# EAGLE design massmfg_tinyx4_v1_1 (EAGLE 6.4)
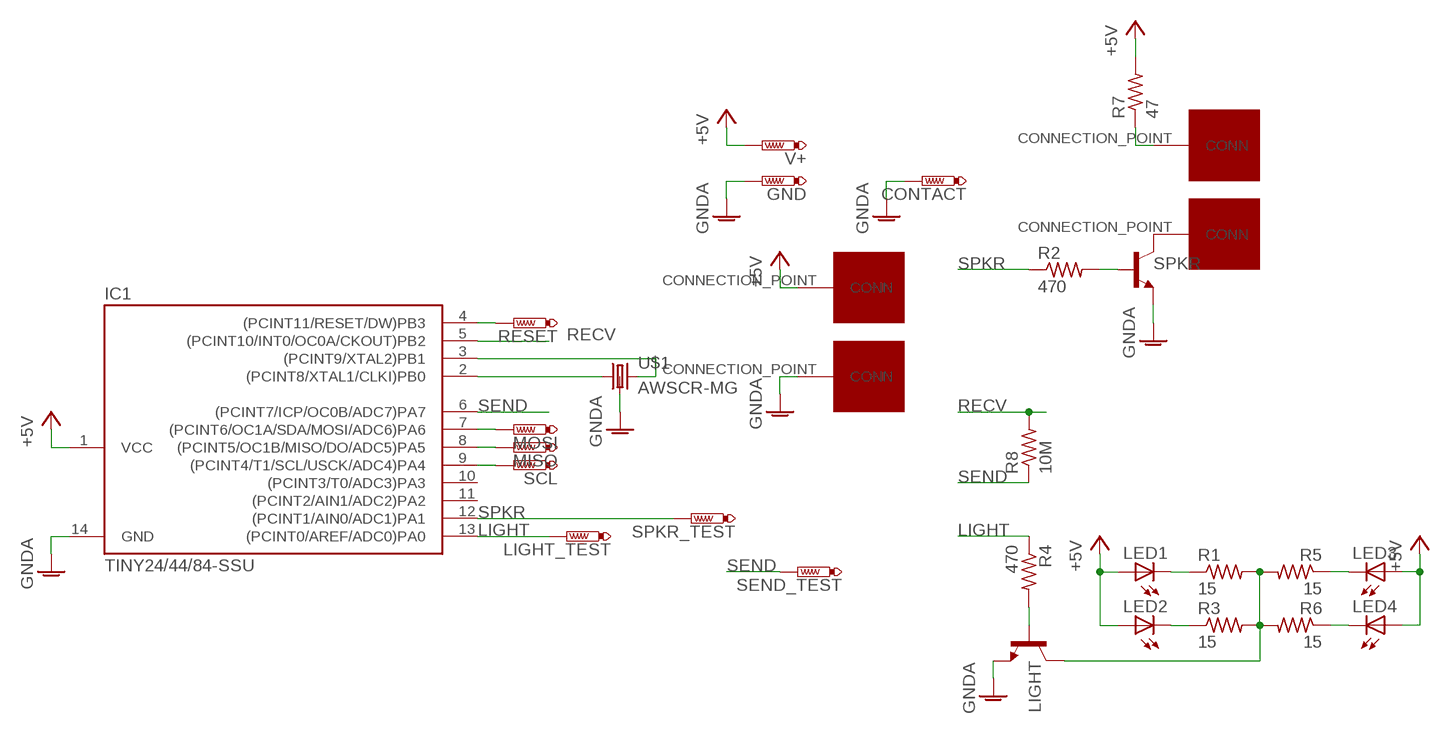
[diagram p0: schematic, sheet 1]

## Parts
CONTACT  PTR1  [P1-06]
GND  PTR1  [P1-06]
IC1  TINY24/44/84-SSU  [SOIC14]
LED1  LEDOPTEK-DURIS5  [OPTEK-DURIS5]
LED2  LEDOPTEK-DURIS5  [OPTEK-DURIS5]
LED3  LEDOPTEK-DURIS5  [OPTEK-DURIS5]
LED4  LEDOPTEK-DURIS5  [OPTEK-DURIS5]
LIGHT  SOT23-BEC  [SOT23-BEC]
LIGHT_TEST  PTR1  [P1-06]
MISO  PTR1  [P1-06]
MOSI  PTR1  [P1-06]
R1  15  R-US_M1206  [M1206]
R2  470  R-US_R0805  [R0805]
R3  15  R-US_M1206  [M1206]
R4  470  R-US_R0805  [R0805]
R5  15  R-US_M1206  [M1206]
R6  15  R-US_M1206  [M1206]
R7  47  R-US_M1206  [M1206]
R8  10M  R-US_M1206  [M1206]
RESET  PTR1  [P1-06]
SCL  PTR1  [P1-06]
SEND_TEST  PTR1  [P1-06]
SPEAKER_PLUS  CONNECTION_POINT  [10X3_CONNECTION_POINT]
SPKR  SOT23-BEC  [SOT23-BEC]
SPKR_MINUS  CONNECTION_POINT  [10X3_CONNECTION_POINT]
SPKR_TEST  PTR1  [P1-06]
U$1  AWSCR-MG  [AWSCR-MG]
U$3  CONNECTION_POINT  [10X3_CONNECTION_POINT]
U$5  CONNECTION_POINT  [10X3_CONNECTION_POINT]
V+  PTR1  [P1-06]

## Nets
+5V: IC1.1(VCC) LED1.ANODE(A) LED2.ANODE(A) LED3.ANODE(A) LED4.ANODE(A) R7.2 U$3.CONNECTION_POINT(CONN) V+.TP
GNDA: CONTACT.TP GND.TP IC1.14(GND) LIGHT.E SPKR.E U$1.GND U$5.CONNECTION_POINT(CONN)
LIGHT: IC1.13((PCINT0/AREF/ADC0)PA0) LIGHT_TEST.TP R4.1
N$1: LIGHT.B R4.2
N$2: IC1.2((PCINT8/XTAL1/CLKI)PB0) U$1.IN
N$3: LED2.CATHODE(C) R3.1
N$4: IC1.3((PCINT9/XTAL2)PB1) U$1.OUT
N$5: LED1.CATHODE(C) R1.1
N$6: R2.2 SPKR.B
N$7: LED3.CATHODE(C) R5.1
N$8: LED4.CATHODE(C) R6.1
N$9: SPKR.C SPKR_MINUS.CONNECTION_POINT(CONN)
N$12: IC1.4((PCINT11/RESET/DW)PB3) RESET.TP
N$13: IC1.7((PCINT6/OC1A/SDA/MOSI/ADC6)PA6) MOSI.TP
N$14: IC1.8((PCINT5/OC1B/MISO/DO/ADC5)PA5) MISO.TP
N$15: IC1.9((PCINT4/T1/SCL/USCK/ADC4)PA4) SCL.TP
N$17: R7.1 SPEAKER_PLUS.CONNECTION_POINT(CONN)
N$18: LIGHT.C R1.2 R3.2 R5.2 R6.2
RECV: IC1.5((PCINT10/INT0/OC0A/CKOUT)PB2) R8.2
SEND: IC1.6((PCINT7/ICP/OC0B/ADC7)PA7) R8.1 SEND_TEST.TP
SPKR: IC1.12((PCINT1/AIN0/ADC1)PA1) R2.1 SPKR_TEST.TP
Unconnected: IC1.10((PCINT3/T0/ADC3)PA3) IC1.11((PCINT2/AIN1/ADC2)PA2)

## Library data of the parts
CONTACT GND LIGHT_TEST MISO MOSI RESET SCL SEND_TEST SPKR_TEST V+ = testpad:PTR1: TEST PIN
IC1 = avr-5:TINY24/44/84
LED1-LED4 = smd_parts:LED: LED OSRAM: - CHIPLED LG R971, LG N971, LY N971, LG Q971, LY Q971, LO R971, LY R971 LH N974, LH R974 LS Q976, LO Q976, LY Q976 LO Q996 - Hyper CHIPLED LW Q18S LB Q993, LB Q99A, LB R99A - SideLED LS A670, LO A670, LY A670, LG A670, LP A670 LB A673, LV A673, LT A673, LW A673 LH A674 LY A675 LS A676, LA A676, LO A676, LY A676, LW A676 LS A679, LY A679, LG A679 - Hyper Micro SIDELED® LS Y876, LA Y876, LO Y876, LY Y876 LT Y87S - SmartLED LW L88C, LW L88S LB L89C, LB L89S, LG L890 LS L89K, LO L89K, LY L89K LS L896, LA L896, LO L896, LY L896 - TOPLED LS T670, LO T670, LY T670, LG T670, LP T670 LSG T670, LSP T670, LSY T670, LOP T670, LYG T670 LG T671, LOG T671, LSG T671 LB T673, LV T673, LT T673, LW T673 LH T674 LS T676, LA T676, LO T676, LY T676, LB T676, LH T676, LSB T676, LW T676 LB T67C, LV T67C, LT T67C, LS T67K, LO T67K, LY T67K, LW E67C LS E67B, LA E67B, LO E67B, LY E67B, LB E67C, LV E67C, LT E67C LW T67C LS T679, LY T679, LG T679 LS T770, LO T770, LY T770, LG T770, LP T770 LB T773, LV T773, LT T773, LW T773 LH T774 LS E675, LA E675, LY E675, LS T675 LS T776, LA T776, LO T776, LY T776, LB T776 LHGB T686 LT T68C, LB T68C - Hyper Mini TOPLED® LB M676 - Mini TOPLED Santana® LG M470 LS M47K, LO M47K, LY M47K Source: http://www.osram.convergy.de LUXEON: - LUMILED® LXK2-PW12-R00, LXK2-PW12-S00, LXK2-PW14-U00, LXK2-PW14-V00 LXK2-PM12-R00, LXK2-PM12-S00, LXK2-PM14-U00 LXK2-PE12-Q00, LXK2-PE12-R00, LXK2-PE12-S00, LXK2-PE14-T00, LXK2-PE14-U00 LXK2-PB12-K00, LXK2-PB12-L00, LXK2-PB12-M00, LXK2-PB14-N00, LXK2-PB14-P00, LXK2-PB14-Q00 LXK2-PR12-L00, LXK2-PR12-M00, LXK2-PR14-Q00, LXK2-PR14-R00 LXK2-PD12-Q00, LXK2-PD12-R00, LXK2-PD12-S00 LXK2-PH12-R00, LXK2-PH12-S00 LXK2-PL12-P00, LXK2-PL12-Q00, LXK2-PL12-R00 Source: www.luxeon.com KINGBRIGHT: KA-3528ASYC Source: www.kingbright.com
LIGHT SPKR = smd_parts:SOT23-BEC
R1-R8 = resistor:R-US_: RESISTOR, American symbol
SPEAKER_PLUS SPKR_MINUS U$3 U$5 = smd_parts:CONNECTION_POINT
U$1 = smd_parts:AWSCR-MG

## Board
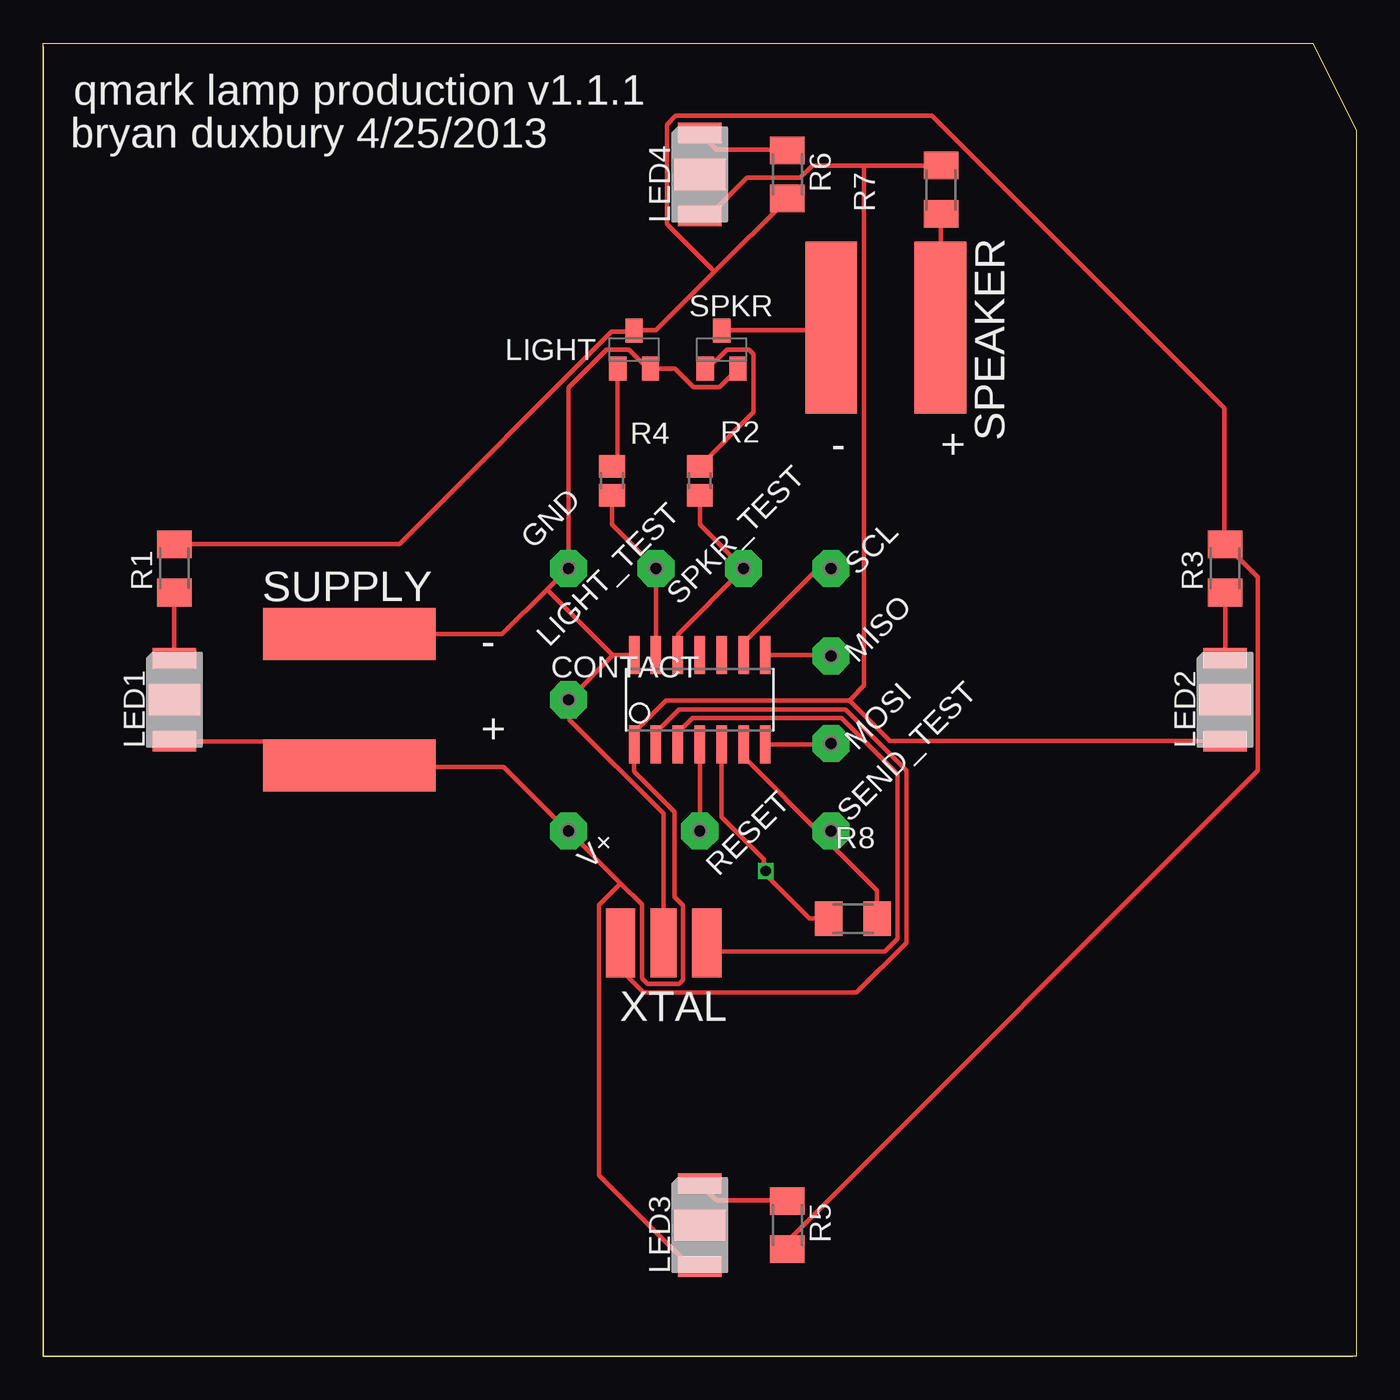
[diagram p1: board, top side]
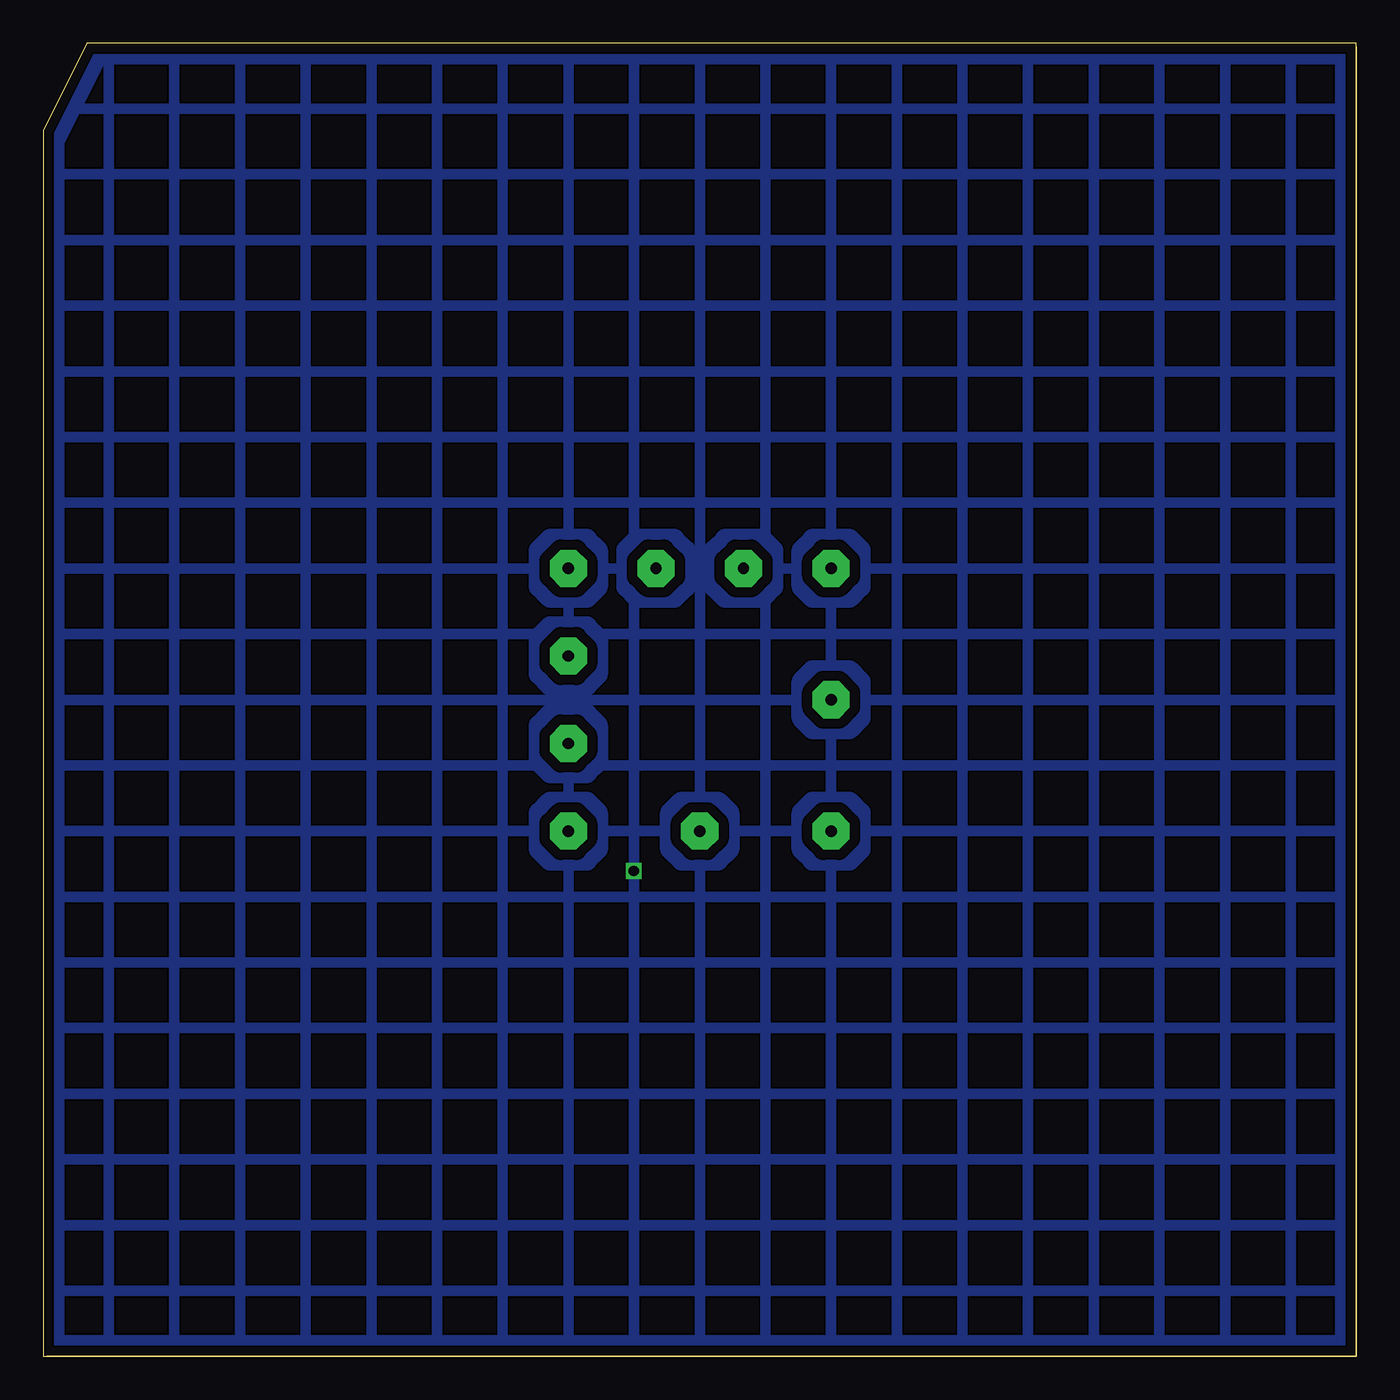
[diagram p2: board, bottom side, seen from below]

Size 76.2 x 76.2 mm. Coordinates in mm from the lower left corner, seen from the top.
Outline: 0,0 76,0
Outline: 0,76 0,0
Outline: 0,0 76.2,0 76.2,71.12 73.66,76.2 0,76.2 0,0
Copper layers (1*16): Top 0.035mm / dielectric 1.5mm / Bottom 0.035mm
Design rules "Fusion_eagle_rule_v1.1 *": minimum track width 10mil, minimum drill 12mil, track to track 10mil, track to pad 10mil, pad to pad 10mil, via to via 10mil, smd to smd 0mil, copper to edge 10mil, drill to drill 10mil, minimum pad ring 10mil, minimum via ring 6mil, stop-mask expansion 2mil, vias tented up to drill 100mil, thermal gap 10mil

### Footprints (pad centres in the part's own frame; a part is rotated, then mirrored left to right if it is on the bottom)
P1-06 = drill 0.66 pad 2.159 octagon: TP 0,0
SOIC14 = smd 0.61 x 2.21: 1 -3.81,-2.603; 2 -2.54,-2.603; 3 -1.27,-2.603; 4 0,-2.603; 5 1.27,-2.603; 6 2.54,-2.603; 7 3.81,-2.603; 8 3.81,2.603; 9 2.54,2.603; 10 1.27,2.603; 11 0,2.603; 12 -1.27,2.603; 13 -2.54,2.603; 14 -3.81,2.603
OPTEK-DURIS5 = smd 2.5 x 1.2: ANODE 0,-2.4; CATHODE 0,2.4 | smd 3 x 1.8: P$5 0,0
SOT23-BEC = smd 1 x 1.4: B -0.95,-1.1; C 0,1.1; E 0.95,-1.1
M1206 = smd 1.6 x 2: 1 -1.4,0; 2 1.4,0
R0805 = smd 1.3 x 1.5: 1 -0.85,0; 2 0.85,0
10X3_CONNECTION_POINT = smd 3 x 10: CONNECTION_POINT 0,0
AWSCR-MG = smd 1.5 x 4: GND 0,0 | smd 1.7 x 4: IN -2.5,0; OUT 2.5,0

### Placement (x,y rotation side)
CONTACT  30.48,38.1 0 top
GND  30.48,45.72 0 top
IC1  38.1,38.1 0 top
LED1  7.62,38.1 0 top
LED2  68.58,38.1 0 top
LED3  38.1,7.62 0 top
LED4  38.1,68.58 0 top
LIGHT  34.29,58.42 0 top
LIGHT_TEST  35.56,45.72 0 top
MISO  45.72,40.64 0 top
MOSI  45.72,35.56 0 top
R1  7.62,45.72 90 top
R2  38.1,50.8 90 top
R3  68.58,45.72 90 top
R4  33.02,50.8 90 top
R5  43.18,7.62 270 top
R6  43.18,68.58 270 top
R7  52.1,67.69 90 top
R8  46.99,25.4 180 top
RESET  38.1,30.48 0 top
SCL  45.72,45.72 0 top
SEND_TEST  45.72,30.48 0 top
SPEAKER_PLUS  52.07,59.69 0 top
SPKR  39.37,58.42 0 top
SPKR_MINUS  45.72,59.69 0 top
SPKR_TEST  40.64,45.72 0 top
U$1  36,24 0 top
U$3  17.78,34.29 90 top
U$5  17.78,41.91 90 top
V+  30.48,30.48 0 top

### Tracks (layer width: path | path; a pad name or v marks a point on that pad's centre or on a via)
+5V
  Top 0.254: LED1.ANODE 7.62,35.69 16.38,35.69 U$3.CONNECTION_POINT 17.88,34.21 26.72,34.21 30.38,30.56 V+.TP 33.52,27.45 | 47.62,69.09 44.63,69.09 43.92,68.38 40.84,68.38 38.66,66.19 38.1,66.19 LED4.ANODE | 47.62,69.09 R7.2 | 33.52,27.45 34.75,26.21 34.75,21.95 35.08,21.61 36.91,21.61 37.13,21.84 37.13,26.16 36.63,26.67 36.63,31.6 34.29,33.93 IC1.1 34.34,35.61 34.34,36.25 36.14,38.05 46.79,38.05 | 33.52,27.45 32.26,26.19 32.26,10.52 37.54,5.23 38.1,5.23 LED3.ANODE | 46.79,38.05 49.12,35.71 68.58,35.71 LED2.ANODE | 47.62,69.09 47.62,38.91 46.86,38.15 46.79,38.05
GNDA
  Top 0.254: 33.07,40.69 IC1.14 | 33.07,40.69 CONTACT.TP 30.56,38 30.56,36.93 35.99,31.5 U$1.GND | SPKR.E 40.31,57.3 39.24,56.24 37.74,56.24 36.68,57.3 35.26,57.3 LIGHT.E 35.13,57.38 35.03,57.38 33.98,58.42 32.69,58.42 30.48,56.21 GND.TP 30.38,45.64 29.23,44.5 | U$5.CONNECTION_POINT 26.64,41.91 29.23,44.5 | 29.23,44.5 32.97,40.77 33.07,40.69
LIGHT
  Top 0.254: R4.1 33.02,48.26 LIGHT_TEST.TP IC1.13
N$1
  Top 0.254: LIGHT.B 33.33,57.3 33.33,51.97 33.02,51.66 R4.2
N$2
  Top 0.254: IC1.2 35.56,36.2 36.91,37.54 46.56,37.54 50.09,34.01 50.09,24 47.19,21.11 34.85,21.11 33.5,22.45 33.5,23.98 U$1.IN
N$3
  Top 0.254: LED2.CATHODE R3.1
N$4
  Top 0.254: IC1.3 36.83,36.2 37.67,37.03 46.33,37.03 49.58,33.78 49.58,24.23 48.84,23.5 38.99,23.5 38.51,23.98 U$1.OUT
N$5
  Top 0.254: LED1.CATHODE R1.1
N$6
  Top 0.254: SPKR.B 38.58,57.33 39.67,58.42 40.97,58.42 41.22,58.17 41.22,54.79 38.1,51.66 R2.2
N$7
  Top 0.254: R5.1 43.18,9.04 39.06,9.04 38.1,10.01 LED3.CATHODE
N$8
  Top 0.254: R6.1 43.18,70 39.06,70 38.1,70.97 LED4.CATHODE
N$9
  Top 0.254: SPKR_MINUS.CONNECTION_POINT 45.57,59.54 39.37,59.54 SPKR.C
N$12
  Top 0.254: RESET.TP IC1.4
N$13
  Top 0.254: MOSI.TP 45.67,35.51 IC1.7
N$14
  Top 0.254: MISO.TP 45.67,40.69 IC1.8
N$15
  Top 0.254: IC1.9 40.64,41.4 44.96,45.72 SCL.TP
N$17
  Top 0.254: R7.1 52.09,59.72 SPEAKER_PLUS.CONNECTION_POINT
N$18
  Top 0.254: 38.95,62.93 43.18,67.16 R6.2 | 38.95,62.93 35.56,59.54 34.29,59.54 LIGHT.C 34.19,59.46 32.99,59.46 20.68,47.14 7.62,47.14 R1.2 | R5.2 43.18,6.68 70.48,33.98 70.48,45.21 R3.2 68.53,47.24 68.53,55.02 51.56,71.98 36.7,71.98 36.2,71.48 36.2,65.68 38.95,62.93
RECV  (via drill 0.6)
  Top 0.254: IC1.5 39.37,31.29 41.83,28.83 41.83,28.17 | 41.83,28.04 41.83,28.17 | R8.2 44.48,25.4 42.01,27.86 41.94,27.96 v41.94,28.17 41.83,28.17
  pour Bottom (isolate 0.61, hatched): 0.25,75.95 75.95,75.95 75.95,0.25 0.25,0.25
SEND
  Top 0.254: SEND_TEST.TP 45.59,30.35 | IC1.6 40.64,34.8 45.49,29.95 SEND_TEST.TP | R8.1 48.39,27.03 45.57,29.84 SEND_TEST.TP
SPKR
  Top 0.254: R2.1 38.1,48.26 SPKR_TEST.TP 40.56,45.62 36.83,41.88 IC1.12

### Text on the board
tNames: qmark lamp production v1.1.1 | bryan duxbury 4/25/2013 | SPEAKER | + | SUPPLY | + | XTAL
_tsilk: - | -